# Altium schematic sheet connectors_to_BMS_master.SchDoc: foxBMS BMS-Extension
size A3; DocumentNumber: 2; SheetNumber: 2; SheetTotal: 14; Author: Fraunhofer IISB foxBMS Team; REL-DATE: 2017-05-16; VERSION: 1.0.2; GateName_1: G$1; SymbolName_1: FRAME_B_L; LibraryName: foxBMS_BMS-Master_V1.00_A; DeviceSetName: FRAME_B_L; GateName_2: G$2; SymbolName_2: DOCFIELD; SheetDescription: Connectors to BMS-Master
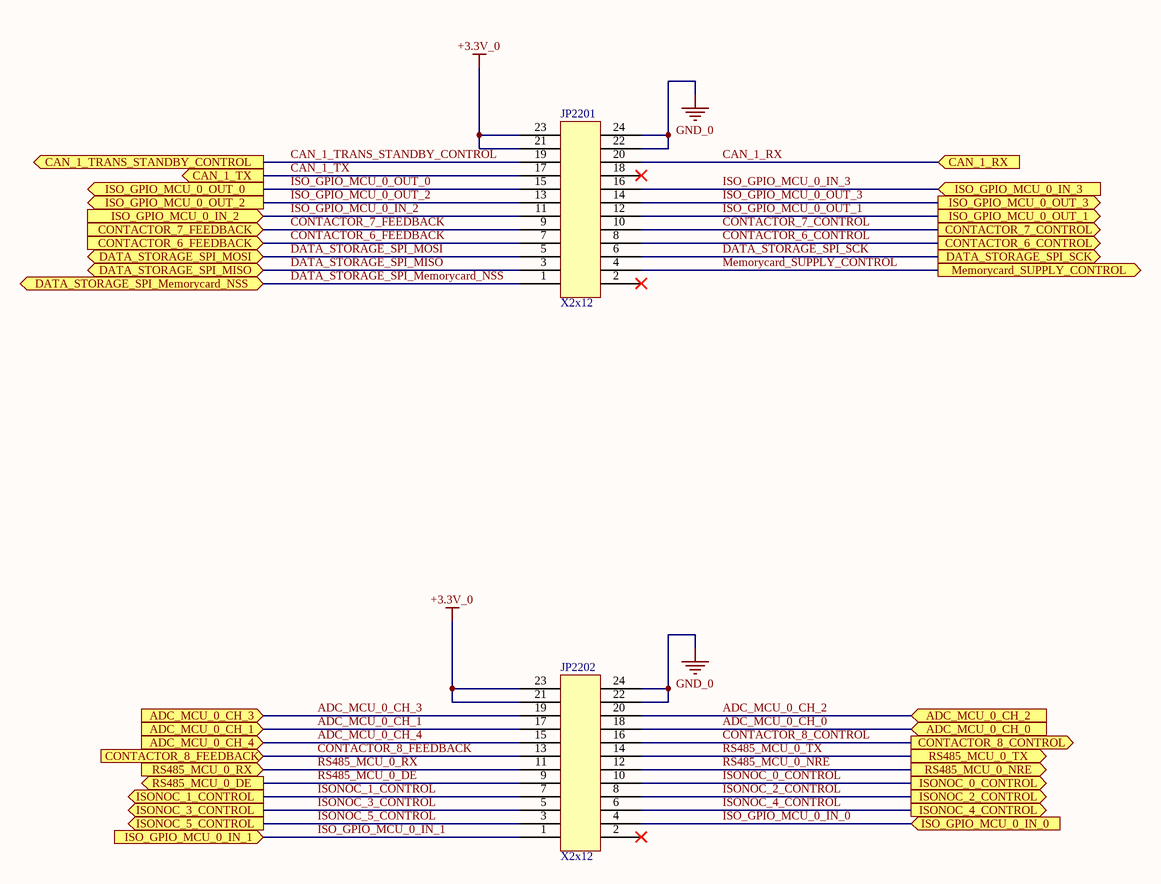
[diagram p0: connectors_to_BMS_master.SchDoc]

## Parts
JP2201  X2x12  [Pinheader_2.54_2x12]
JP2202  X2x12  [Pinheader_2.54_2x12]

## Ports
ADC_MCU_0_CH_0 (in), ADC_MCU_0_CH_1 (in), ADC_MCU_0_CH_2 (in), ADC_MCU_0_CH_3 (in), ADC_MCU_0_CH_4 (in), CAN_1_RX (in), CAN_1_TRANS_STANDBY_CONTROL (out), CAN_1_TX (out), CONTACTOR_6_CONTROL (out), CONTACTOR_6_FEEDBACK (in), CONTACTOR_7_CONTROL (out), CONTACTOR_7_FEEDBACK (in), CONTACTOR_8_CONTROL (out), CONTACTOR_8_FEEDBACK (in), DATA_STORAGE_SPI_Memorycard_NSS (bidir), DATA_STORAGE_SPI_MISO (bidir), DATA_STORAGE_SPI_MOSI (bidir), DATA_STORAGE_SPI_SCK (out), ISO_GPIO_MCU_0_IN_0 (in), ISO_GPIO_MCU_0_IN_1 (in), ISO_GPIO_MCU_0_IN_2 (in), ISO_GPIO_MCU_0_IN_3 (in), ISO_GPIO_MCU_0_OUT_0 (out), ISO_GPIO_MCU_0_OUT_1 (out), ISO_GPIO_MCU_0_OUT_2 (out), ISO_GPIO_MCU_0_OUT_3 (out), ISONOC_0_CONTROL (out), ISONOC_1_CONTROL (out), ISONOC_2_CONTROL (out), ISONOC_3_CONTROL (out), ISONOC_4_CONTROL (out), ISONOC_5_CONTROL (out), Memorycard_SUPPLY_CONTROL (out), RS485_MCU_0_DE (out), RS485_MCU_0_NRE (out), RS485_MCU_0_RX (in), RS485_MCU_0_TX (out)

## Nets
+3.3V_0: JP2201.21 JP2201.23 JP2202.21 JP2202.23
GND_0: JP2201.22 JP2201.24 JP2202.22 JP2202.24
ADC_MCU_0_CH_0: JP2202.18 ; port ADC_MCU_0_CH_0
ADC_MCU_0_CH_1: JP2202.17 ; port ADC_MCU_0_CH_1
ADC_MCU_0_CH_2: JP2202.20 ; port ADC_MCU_0_CH_2
ADC_MCU_0_CH_3: JP2202.19 ; port ADC_MCU_0_CH_3
ADC_MCU_0_CH_4: JP2202.15 ; port ADC_MCU_0_CH_4
CAN_1_RX: JP2201.20 ; port CAN_1_RX
CAN_1_TRANS_STANDBY_CONTROL: JP2201.19 ; port CAN_1_TRANS_STANDBY_CONTROL
CAN_1_TX: JP2201.17 ; port CAN_1_TX
CONTACTOR_6_CONTROL: JP2201.8 ; port CONTACTOR_6_CONTROL
CONTACTOR_6_FEEDBACK: JP2201.7 ; port CONTACTOR_6_FEEDBACK
CONTACTOR_7_CONTROL: JP2201.10 ; port CONTACTOR_7_CONTROL
CONTACTOR_7_FEEDBACK: JP2201.9 ; port CONTACTOR_7_FEEDBACK
CONTACTOR_8_CONTROL: JP2202.16 ; port CONTACTOR_8_CONTROL
CONTACTOR_8_FEEDBACK: JP2202.13 ; port CONTACTOR_8_FEEDBACK
DATA_STORAGE_SPI_Memorycard_NSS: JP2201.1 ; port DATA_STORAGE_SPI_Memorycard_NSS
DATA_STORAGE_SPI_MISO: JP2201.3 ; port DATA_STORAGE_SPI_MISO
DATA_STORAGE_SPI_MOSI: JP2201.5 ; port DATA_STORAGE_SPI_MOSI
DATA_STORAGE_SPI_SCK: JP2201.6 ; port DATA_STORAGE_SPI_SCK
ISO_GPIO_MCU_0_IN_0: JP2202.4 ; port ISO_GPIO_MCU_0_IN_0
ISO_GPIO_MCU_0_IN_1: JP2202.1 ; port ISO_GPIO_MCU_0_IN_1
ISO_GPIO_MCU_0_IN_2: JP2201.11 ; port ISO_GPIO_MCU_0_IN_2
ISO_GPIO_MCU_0_IN_3: JP2201.16 ; port ISO_GPIO_MCU_0_IN_3
ISO_GPIO_MCU_0_OUT_0: JP2201.15 ; port ISO_GPIO_MCU_0_OUT_0
ISO_GPIO_MCU_0_OUT_1: JP2201.12 ; port ISO_GPIO_MCU_0_OUT_1
ISO_GPIO_MCU_0_OUT_2: JP2201.13 ; port ISO_GPIO_MCU_0_OUT_2
ISO_GPIO_MCU_0_OUT_3: JP2201.14 ; port ISO_GPIO_MCU_0_OUT_3
ISONOC_0_CONTROL: JP2202.10 ; port ISONOC_0_CONTROL
ISONOC_1_CONTROL: JP2202.7 ; port ISONOC_1_CONTROL
ISONOC_2_CONTROL: JP2202.8 ; port ISONOC_2_CONTROL
ISONOC_3_CONTROL: JP2202.5 ; port ISONOC_3_CONTROL
ISONOC_4_CONTROL: JP2202.6 ; port ISONOC_4_CONTROL
ISONOC_5_CONTROL: JP2202.3 ; port ISONOC_5_CONTROL
Memorycard_SUPPLY_CONTROL: JP2201.4 ; port Memorycard_SUPPLY_CONTROL
RS485_MCU_0_DE: JP2202.9 ; port RS485_MCU_0_DE
RS485_MCU_0_NRE: JP2202.12 ; port RS485_MCU_0_NRE
RS485_MCU_0_RX: JP2202.11 ; port RS485_MCU_0_RX
RS485_MCU_0_TX: JP2202.14 ; port RS485_MCU_0_TX

Not connected (* = marked no-connect by the designer): JP2201 2* 18*; JP2202 2*

## Notes on the sheet
- Fraunhofer IISB
- Schottkystr. 10
- developed by:
- 91058 Erlangen
- Germany
- Author
- Project
- License
- Description
- File
- Version
- Release Date
- Sheet
- www.foxbms.org
- www.iisb.fraunhofer.de
- foxBMS Team
- /

## Library data of the parts
JP2201 JP2202 = samtec_TLW-112-06-G-D: Board-To-Board Connector, Vertical, Low Profile, 2.54 mm, 24 Contacts, Header, TLW Series, Through Hole, 2 Rows; Manufacturer: Samtec; Circuits: 24; Part Number: samtec_TLW-112-06-G-D; Part Name: TLW-112-06-G-D; Operating Temperature: -55°C - +125°C; ComponentLink1Description: Datasheet; ComponentLink1URL: http://suddendocs.samtec.com/catalog_english/tlw_th.pdf; Supplier 1: Digikey; Supplier Part Number 1: SAM1096-12-ND